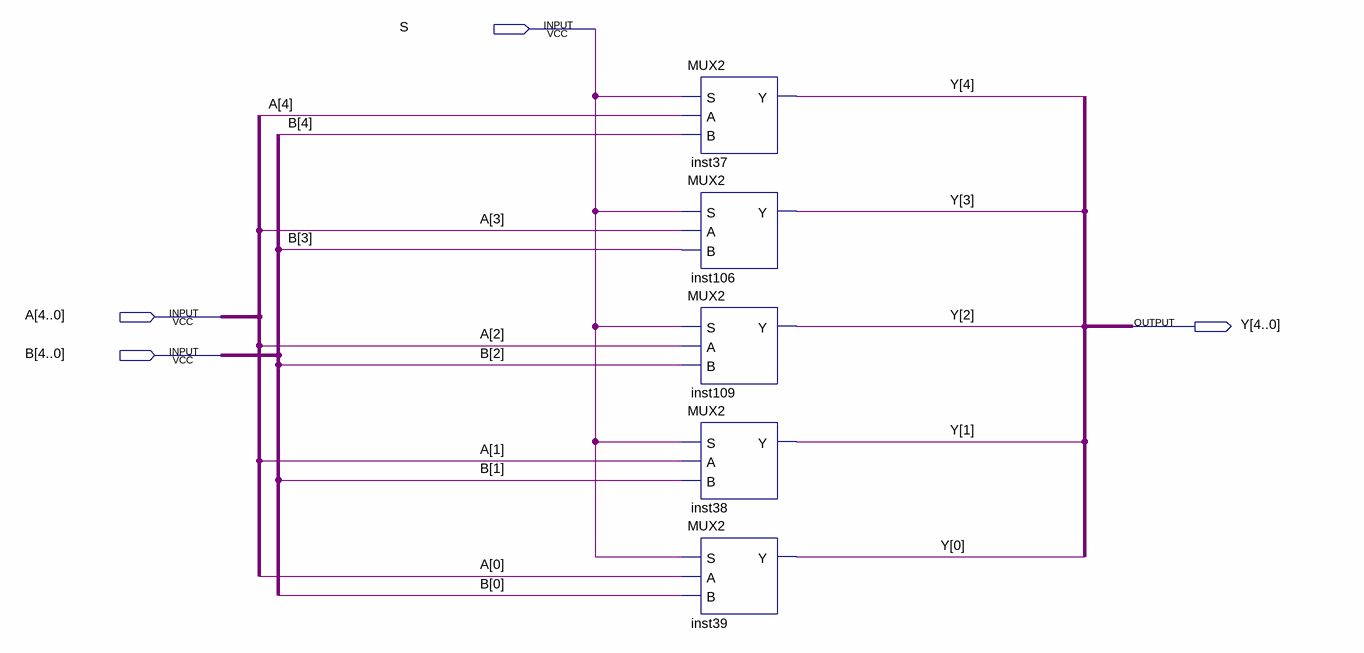
[diagram p0: schematic sheet]
// Quartus schematic MUX2_5.bdf as structural Verilog: 5 symbols, 4 pins
module MUX2_5 (
  input  S,
  input  [4:0] A,
  input  [4:0] B,
  output [4:0] Y
);

  MUX2 inst37 (.S(S), .A(A[4]), .B(B[4]), .Y(Y[4]));
  MUX2 inst106 (.S(S), .A(A[3]), .B(B[3]), .Y(Y[3]));
  MUX2 inst109 (.S(S), .A(A[2]), .B(B[2]), .Y(Y[2]));
  MUX2 inst38 (.S(S), .A(A[1]), .B(B[1]), .Y(Y[1]));
  MUX2 inst39 (.S(S), .A(A[0]), .B(B[0]), .Y(Y[0]));
endmodule
